# EAGLE design board (EAGLE 9.6.2)
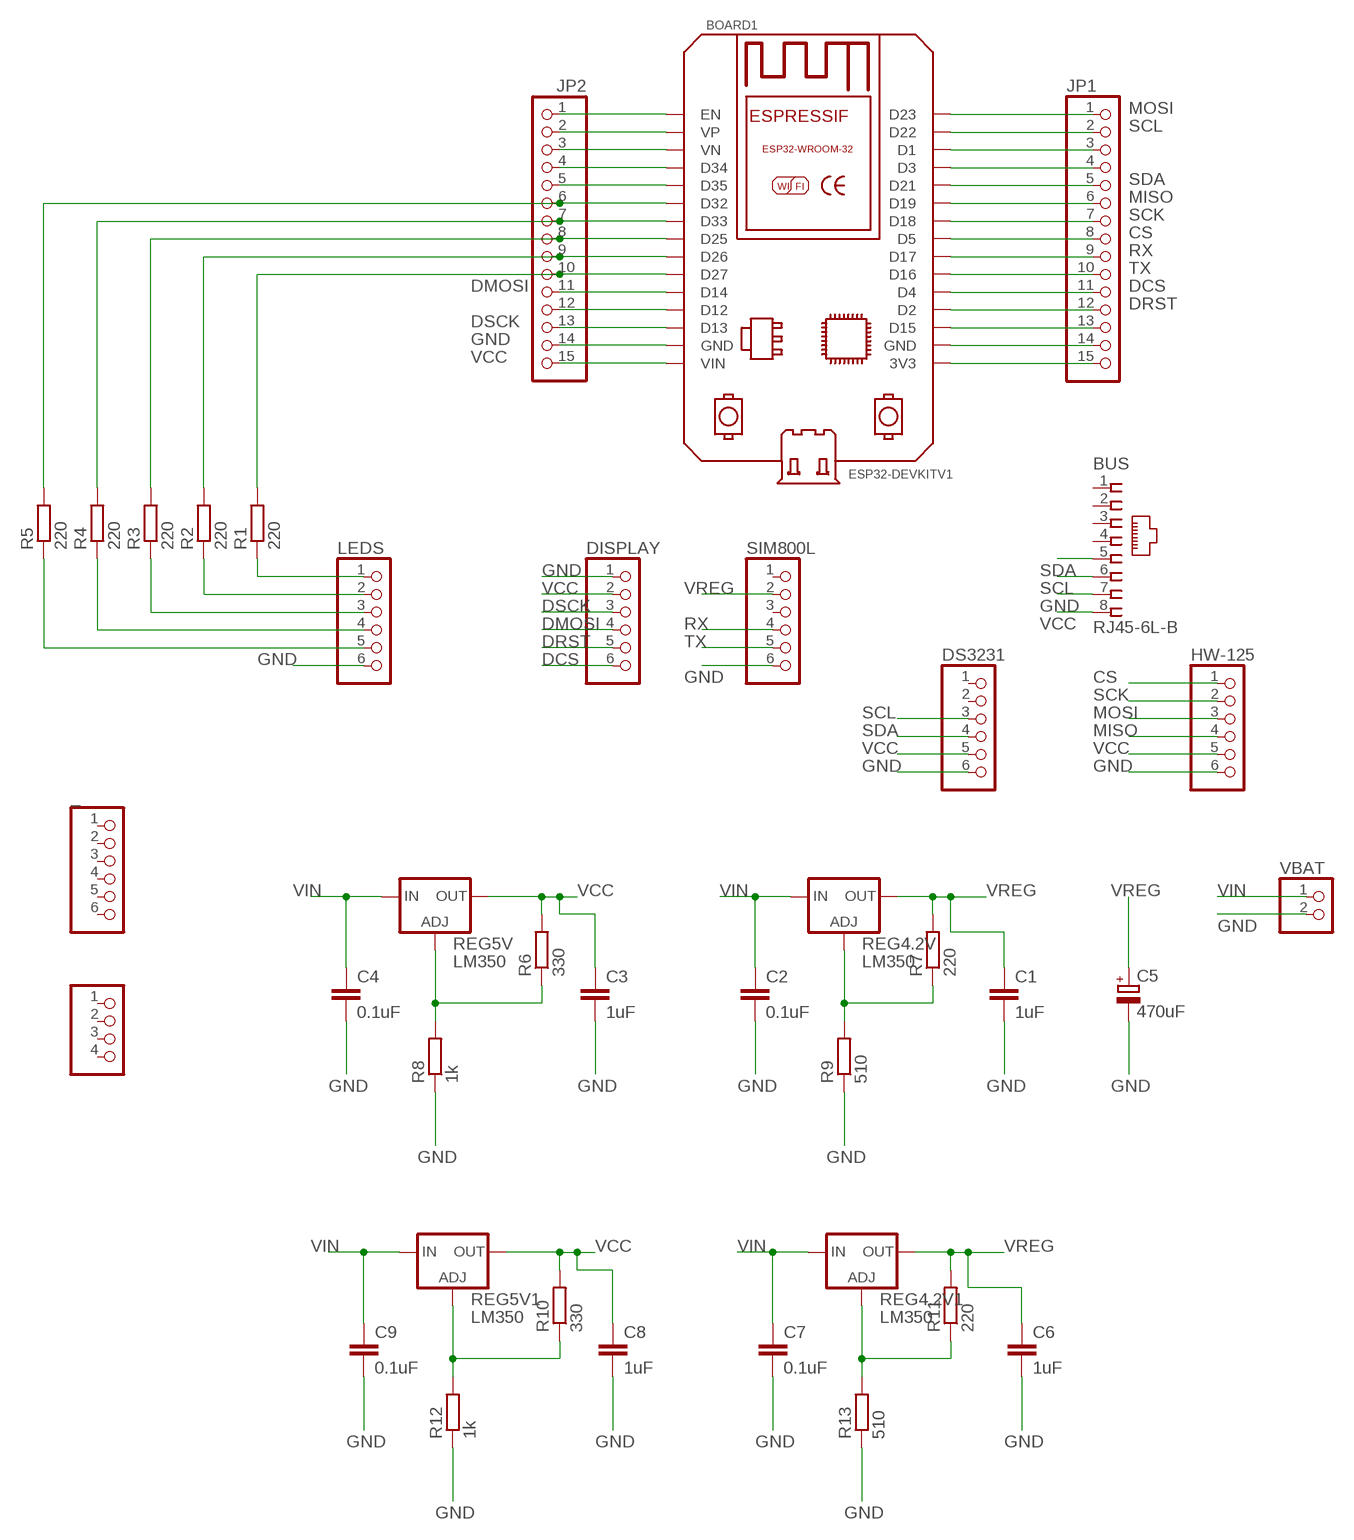
[diagram p0: schematic, sheet 1]

## Parts
_  PINHD-1X6  [1X06]
BOARD1  ESP32DEVKITV1  [ESP32-DEVKITV1]
BUS  RJ45-6L-B  [RJ45-NO-SHIELD]
C1  1uF  C2.5/2  [C2.5-2]
C2  0.1uF  C2.5/2  [C2.5-2]
C3  1uF  C2.5/2  [C2.5-2]
C4  0.1uF  C2.5/2  [C2.5-2]
C5  470uF  CPOL-EUE3.5-8  [E3,5-8]
C6  1uF  C2.5/2  [C2.5-2]
C7  0.1uF  C2.5/2  [C2.5-2]
C8  1uF  C2.5/2  [C2.5-2]
C9  0.1uF  C2.5/2  [C2.5-2]
DISPLAY  PINHD-1X6  [1X06]
DS3231  PINHD-1X6  [1X06]
HW-125  PINHD-1X6  [1X06]
JP1  PINHD-1X15  [1X15]
JP2  PINHD-1X15  [1X15]
JP3  PINHD-1X4  [1X04]
LEDS  PINHD-1X6  [1X06]
R1  220  R-EU_R1206  [R1206]
R2  220  R-EU_R1206  [R1206]
R3  220  R-EU_R1206  [R1206]
R4  220  R-EU_R1206  [R1206]
R5  220  R-EU_R1206  [R1206]
R6  330  R-EU_0204/7  [0204/7]
R7  220  R-EU_0204/7  [0204/7]
R8  1k  R-EU_0204/7  [0204/7]
R9  510  R-EU_0204/7  [0204/7]
R10  330  R-EU_0204/7  [0204/7]
R11  220  R-EU_0204/7  [0204/7]
R12  1k  R-EU_0204/7  [0204/7]
R13  510  R-EU_0204/7  [0204/7]
REG4.2V  LM350  LM317TS  [317TS]
REG4.2V1  LM350  LM317TS  [317TS]
REG5V  LM350  LM317TS  [317TS]
REG5V1  LM350  LM317TS  [317TS]
SIM800L  PINHD-1X6  [1X06]
VBAT  PINHD-1X2  [1X02]

## Nets
CS: BOARD1.D5 HW-125.1 JP1.8
DCS: BOARD1.D4 DISPLAY.6 JP1.11
DMOSI: BOARD1.D14 DISPLAY.4 JP2.11
DRST: BOARD1.D2 DISPLAY.5 JP1.12
DSCK: BOARD1.D13 DISPLAY.3 JP2.13
GND: BOARD1.GND BUS.7 C1.2 C2.2 C3.2 C4.2 C5.- C6.2 C7.2 C8.2 C9.2 DISPLAY.1 DS3231.6 HW-125.6 JP2.14 LEDS.6 R8.1 R9.1 R12.1 R13.1 SIM800L.6 VBAT.2
MISO: BOARD1.D19 HW-125.4 JP1.6
MOSI: BOARD1.D23 HW-125.3 JP1.1
N$1: BOARD1.EN JP2.1
N$2: BOARD1.VP JP2.2
N$3: BOARD1.VN JP2.3
N$4: BOARD1.D34 JP2.4
N$5: BOARD1.D35 JP2.5
N$6: BOARD1.D32 JP2.6 R5.2
N$7: BOARD1.D33 JP2.7 R4.2
N$8: BOARD1.D25 JP2.8 R3.2
N$9: BOARD1.D26 JP2.9 R2.2
N$10: BOARD1.D27 JP2.10 R1.2
N$11: LEDS.1 R1.1
N$12: BOARD1.D12 JP2.12
N$13: LEDS.2 R2.1
N$14: LEDS.3 R3.1
N$15: LEDS.4 R4.1
N$16: LEDS.5 R5.1
N$17: BOARD1.3V3 JP1.15
N$18: BOARD1.D1 JP1.3
N$19: BOARD1.D3 JP1.4
N$20: BOARD1.GND@1(GND) JP1.14
N$21: R6.1 R8.2 REG5V.1(ADJ)
N$22: R7.1 R9.2 REG4.2V.1(ADJ)
N$23: R10.1 R12.2 REG5V1.1(ADJ)
N$24: R11.1 R13.2 REG4.2V1.1(ADJ)
N$28: BOARD1.D15 JP1.13
RX: BOARD1.D17 JP1.9 SIM800L.4
SCK: BOARD1.D18 HW-125.2 JP1.7
SCL: BOARD1.D22 BUS.6 DS3231.3 JP1.2
SDA: BOARD1.D21 BUS.5 DS3231.4 JP1.5
TX: BOARD1.D16 JP1.10 SIM800L.5
VCC: BOARD1.VIN BUS.8 C3.1 C8.1 DISPLAY.2 DS3231.5 HW-125.5 JP2.15 R6.2 R10.2 REG5V1.2(OUT) REG5V.2(OUT)
VIN: C2.1 C4.1 C7.1 C9.1 REG4.2V1.3(IN) REG4.2V.3(IN) REG5V1.3(IN) REG5V.3(IN) VBAT.1
VREG: C1.1 C5.+ C6.1 R7.2 R11.2 REG4.2V1.2(OUT) REG4.2V.2(OUT) SIM800L.2
Unconnected: _.1 _.2 _.3 _.4 _.5 _.6 BUS.1 BUS.2 BUS.3 BUS.4 DS3231.1 DS3231.2 JP3.1 JP3.2 JP3.3 JP3.4 SIM800L.1 SIM800L.3

## Library data of the parts
_ DISPLAY DS3231 HW-125 LEDS SIM800L = pinhead:PINHD-1X6: PIN HEADER
BOARD1 = ESP32-DEVKITV1:ESP32DEVKITV1: https://github.com/shridattdudhat
BUS = con-tycoelectronics:RJ45: CORCOM Modular RJ Jacks No Shield Source: www.tycoelectronics.com .. ENG_DS_1654001_1099_RJ_L_0507.pdf; MPN: RJ45-6L-B; OC_FARNELL: unknown; OC_NEWARK: 16R6090
C1-C4 C6-C9 = capacitor-wima:C: CAPACITOR naming: grid - package width
C5 = rcl:CPOL-EU: POLARIZED CAPACITOR, European symbol; SPICEPREFIX: C
JP1 JP2 = pinhead:PINHD-1X15: PIN HEADER
JP3 = pinhead:PINHD-1X4: PIN HEADER
R1-R13 = rcl:R-EU_: RESISTOR, European symbol; SPICEPREFIX: R
REG4.2V REG4.2V1 REG5V REG5V1 = v-reg:LM317TS: VOLTAGE REGULATOR
VBAT = pinhead:PINHD-1X2: PIN HEADER

## Board
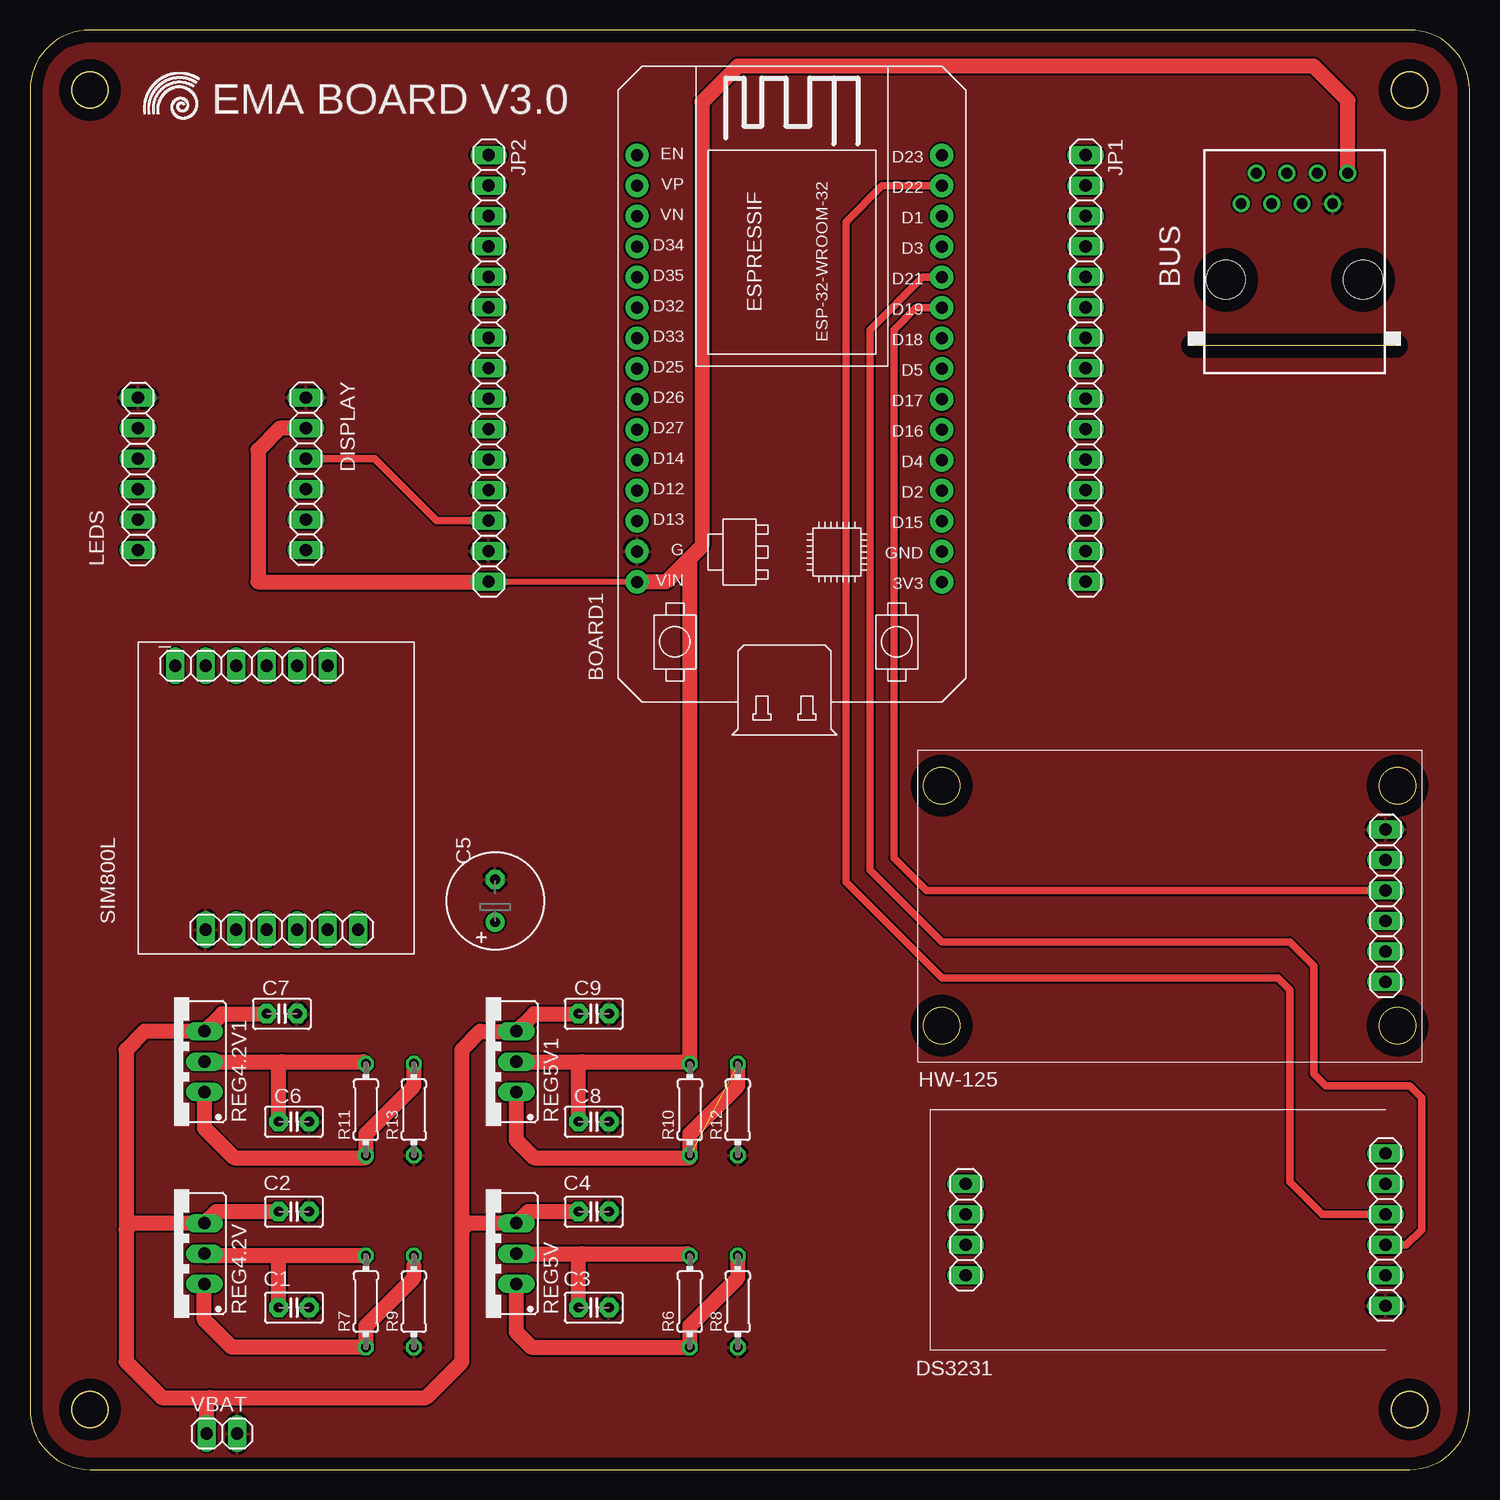
[diagram p1: board, top side]
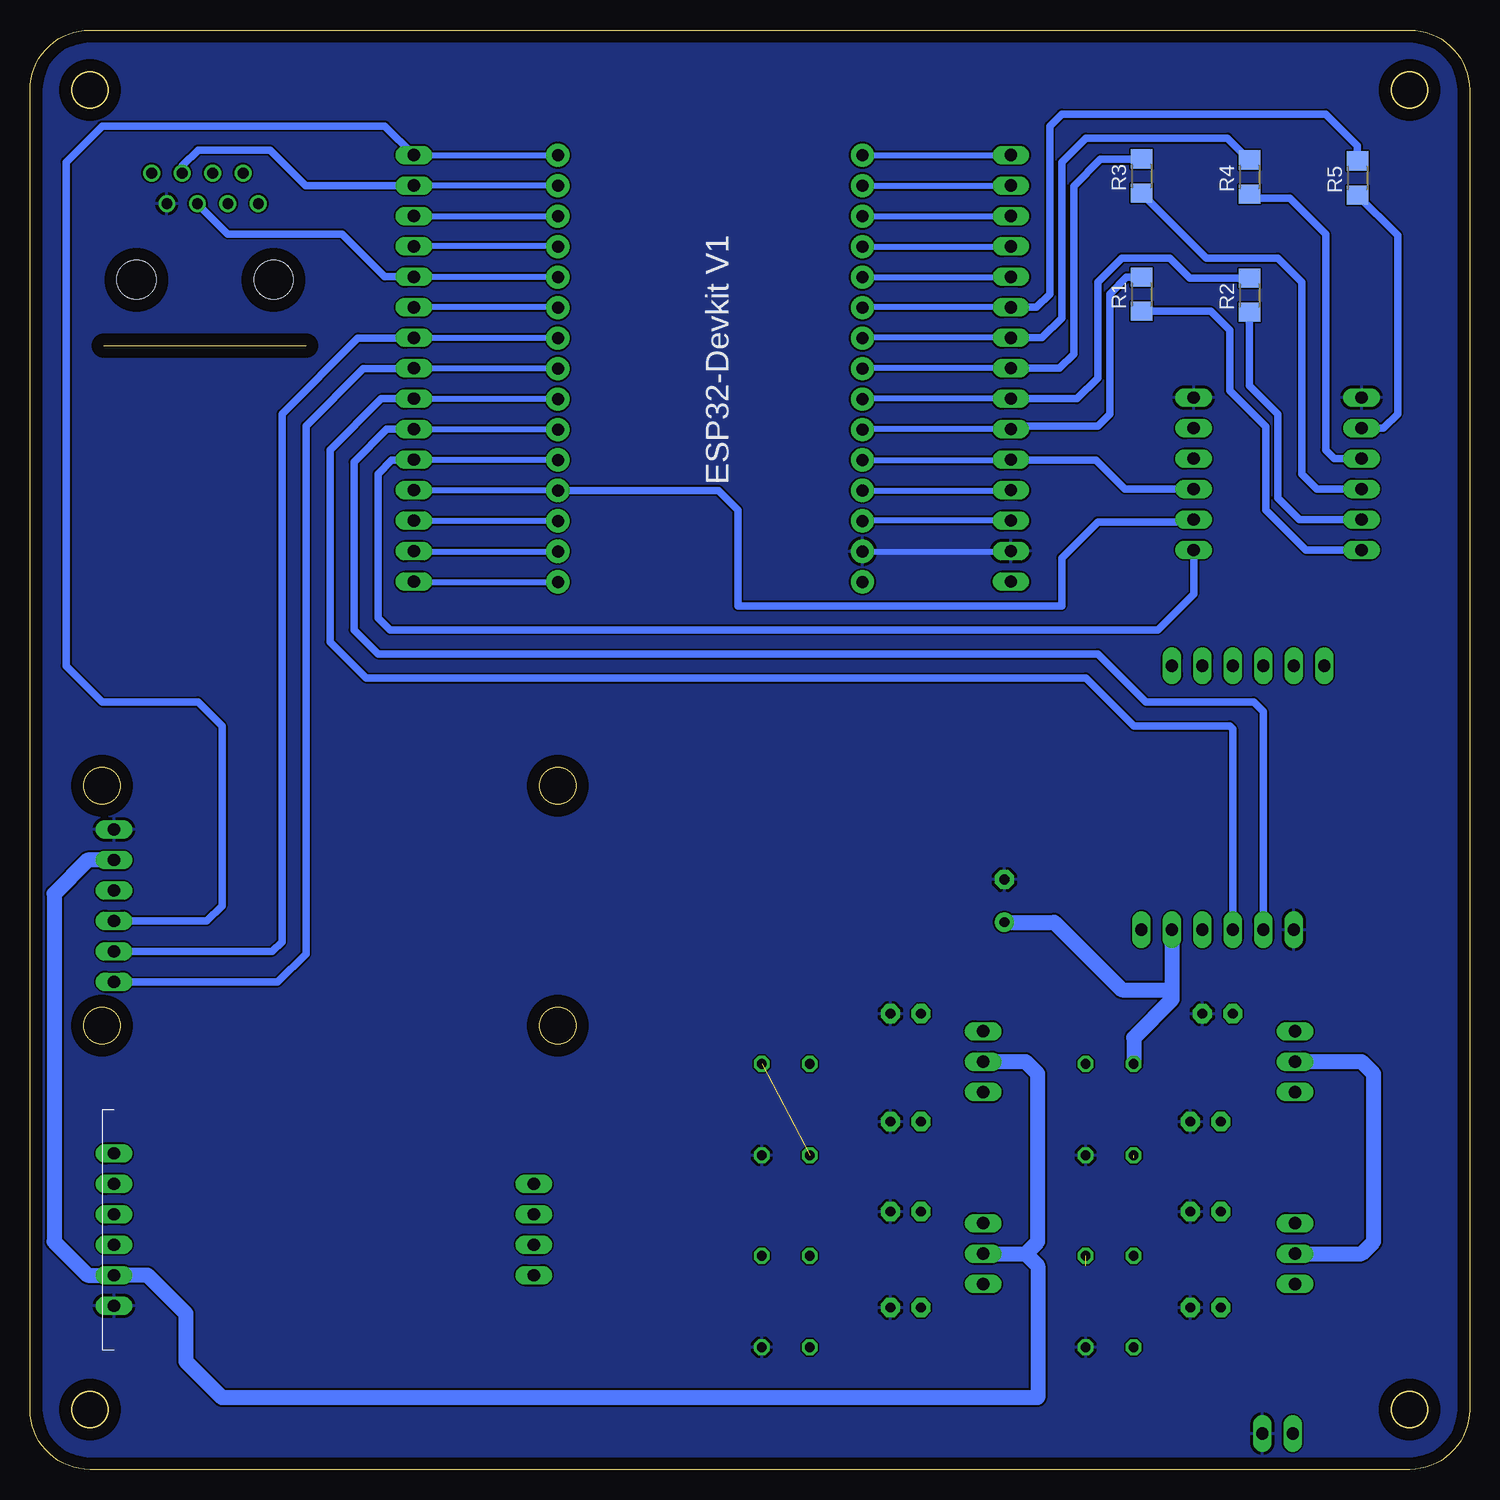
[diagram p2: board, bottom side, seen from below]

Size 120 x 120 mm. Coordinates in mm from the lower left corner, seen from the top.
Outline: 0,115 0,5 arc90 5,0 115,0 arc90 120,5 120,115 arc90 115,120 5,120 arc90 0,115
Outline: circle at 5,115 radius 1.5
Outline: circle at 115,115 radius 1.5
Outline: circle at 5,5 radius 1.5
Outline: circle at 115,5 radius 1.5
Outline: circle at 114,57 radius 1.5
Outline: circle at 114,37 radius 1.5
Outline: circle at 76,37 radius 1.5
Outline: circle at 76,57 radius 1.5
Copper layers (1*16): Top 0.035mm / dielectric 1.5mm / Bottom 0.035mm
Design rules "default": minimum track width 6mil, minimum drill 0.35mm, track to track 6mil, track to pad 6mil, pad to pad 6mil, via to via 6mil, smd to smd 6mil, copper to edge 40mil, drill to drill 6mil, minimum pad ring 10mil, minimum via ring 8mil, stop-mask expansion 4mil, vias tented up to drill 0mil, thermal gap 10mil

### Footprints (pad centres in the part's own frame; a part is rotated, then mirrored left to right if it is on the bottom)
1X06 = drill 1.016 long: 1 -6.35,0; 2 -3.81,0; 3 -1.27,0; 4 1.27,0; 5 3.81,0; 6 6.35,0
ESP32-DEVKITV1 = drill 1 pad 1.93: 3V3 0,0; D1 30.48,0; D2 7.62,0; D3 27.94,0; D4 10.16,0; D5 17.78,0; D12 7.62,25.4; D13 5.08,25.4; D14 10.16,25.4; D15 5.08,0; D16 12.7,0; D17 15.24,0; D18 20.32,0; D19 22.86,0; D21 25.4,0; D22 33.02,0; D23 35.56,0; D25 17.78,25.4; D26 15.24,25.4; D27 12.7,25.4; D32 22.86,25.4; D33 20.32,25.4; D34 27.94,25.4; D35 25.4,25.4; EN 35.56,25.4; GND 2.54,25.4; GND@1 2.54,0; VIN 0,25.4; VN 30.48,25.4; VP 33.02,25.4
RJ45-NO-SHIELD = drill 0.9 pad 1.4: 1 -4.445,6.35; 2 -3.175,8.89; 3 -1.905,6.35; 4 -0.635,8.89; 5 0.635,6.35; 6 1.905,8.89; 7 3.175,6.35; 8 4.445,8.89 | hole 3.251: -5.715,0; 5.715,0
C2.5-2 = drill 0.813 pad 1.6 octagon: 1 -1.27,0; 2 1.27,0
E3,5-8 = drill 0.813 pad 1.6: + -1.778,0 | drill 0.813 pad 1.6 octagon: - 1.778,0
1X15 = drill 1.016 long: 1 -17.78,0; 2 -15.24,0; 3 -12.7,0; 4 -10.16,0; 5 -7.62,0; 6 -5.08,0; 7 -2.54,0; 8 0,0; 9 2.54,0; 10 5.08,0; 11 7.62,0; 12 10.16,0; 13 12.7,0; 14 15.24,0; 15 17.78,0
1X04 = drill 1.016 long: 1 -3.81,0; 2 -1.27,0; 3 1.27,0; 4 3.81,0
R1206 = smd 1.6 x 1.803: 1 -1.422,0; 2 1.422,0
0204/7 = drill 0.813 octagon: 1 -3.81,0; 2 3.81,0
317TS = drill 1.016 long: 1 -2.54,-2.54; 2 0,-2.54; 3 2.54,-2.54
1X02 = drill 1.016 long: 1 -1.27,0; 2 1.27,0

### Placement (x,y rotation side)
_  18.46,67 0 top
BOARD1  76,74 90 top
BUS  105.41,99.18 0 top
C1  22,13.5 0 top
C2  22,21.5 0 top
C3  47,13.5 0 top
C4  47,21.5 0 top
C5  38.78,47.4 90 top
C6  22,29 0 top
C7  21,38 0 top
C8  47,29 0 top
C9  47,38 0 top
DISPLAY  23,83 270 top
DS3231  113,20 270 top
HW-125  113,47 90 top
JP1  88,91.8 270 top
JP2  38.23,91.8 270 top
JP3  78,20 90 top
LEDS  9,83 90 top
R1  27.34,97.98 90 bottom
R2  18.34,97.9 90 bottom
R3  27.34,107.82 90 bottom
R4  18.34,107.74 90 bottom
R5  9.34,107.66 90 bottom
R6  55,14 90 top
R7  28,14 90 top
R8  59,14 90 top
R9  32,14 90 top
R10  55,30 90 top
R11  28,30 90 top
R12  59,30 90 top
R13  32,30 90 top
REG4.2V  12,18 90 top
REG4.2V1  12,34 90 top
REG5V  38,18 90 top
REG5V1  38,34 90 top
SIM800L  21,45 180 top
VBAT  16,3 0 top

### Tracks (layer width: path | path; a pad name or v marks a point on that pad's centre or on a via)
CS
  Bottom 0.508: BOARD1.D5 87.98,91.78 JP1.8
  Bottom 0.61: HW-125.1 99.35,40.65 97,43 97,87 92.22,91.78 87.98,91.78
DCS
  Bottom 0.508: BOARD1.D4 87.98,84.16 JP1.11
  Bottom 0.61: DISPLAY.6 23,73 26,70 90,70 91,71 91,83 89.84,84.16 87.98,84.16
DMOSI
  Bottom 0.508: BOARD1.D14 38.25,84.16 JP2.11
  Bottom 0.61: DISPLAY.4 28.73,81.73 31.16,84.16 38.25,84.16
DRST
  Bottom 0.508: BOARD1.D2 87.98,81.62 JP1.12
  Bottom 0.61: DISPLAY.5 23.19,79 31,79 34,76 34,72 61,72 61,80 62.62,81.62 BOARD1.D2
DSCK
  Top 0.61: DISPLAY.3 28.73,84.27 33.9,79.1 JP2.13
  Bottom 0.508: JP2.13 50.58,79.1 BOARD1.D13
GND
  Bottom 0.508: BOARD1.GND 38.25,76.54 JP2.14
  pour Top: 115.59,1 4.41,1 arc-90 1,4.41 1,115.59 arc-90 4.41,119 115.59,119 arc-90 119,115.59 119,4.41 arc-90
  pour Bottom: 115.59,1 4.41,1 arc-90 1,4.41 1,115.59 arc-90 4.41,119 115.59,119 arc-90 119,115.59 119,4.41 arc-90
MISO
  Top 0.61: BOARD1.D19 73.86,96.86 72,95 72,51 74.73,48.27 HW-125.4
  Bottom 0.508: BOARD1.D19 76.02,96.88 JP1.6
MOSI
  Bottom 0.508: JP1.1 76.02,109.58 BOARD1.D23
  Bottom 0.61: JP1.1 90.42,112 114,112 117,109 117,67 114,64 106,64 104,62 104,47 105.27,45.73 HW-125.3
N$1
  Bottom 0.508: BOARD1.EN 38.25,109.56 JP2.1
N$2
  Bottom 0.508: BOARD1.VP 38.25,107.02 JP2.2
N$3
  Bottom 0.508: BOARD1.VN 38.25,104.48 JP2.3
N$4
  Bottom 0.508: BOARD1.D34 38.25,101.94 JP2.4
N$5
  Bottom 0.508: BOARD1.D35 38.25,99.4 JP2.5
N$6
  Bottom 0.508: JP2.6 50.58,96.88 BOARD1.D32
  Bottom 0.61: JP2.6 36.12,96.88 35,98 35,112 34,113 12,113 9.34,110.34 R5.2
N$7
  Bottom 0.508: JP2.7 50.58,94.34 BOARD1.D33
  Bottom 0.61: JP2.7 35.66,94.34 34,96 34,109 32,111 20.18,111 R4.2
N$8
  Bottom 0.508: JP2.8 50.58,91.8 BOARD1.D25
  Bottom 0.61: JP2.8 34.2,91.8 33,93 33,107 30.76,109.24 R3.2
N$9
  Bottom 0.508: JP2.9 50.58,89.26 BOARD1.D26
  Bottom 0.61: R2.2 23.32,99.32 25,101 29,101 31,99 31,91 32.74,89.26 JP2.9
N$10
  Bottom 0.508: JP2.10 50.58,86.72 BOARD1.D27
  Bottom 0.61: JP2.10 37.95,87 31,87 30,88 30,98 28.6,99.4 R1.2
N$11
  Bottom 0.61: LEDS.1 13.65,76.65 17,80 17,86.92 18.04,87.96 20,89.92 20,95 21.56,96.56 R1.1
N$12
  Bottom 0.508: BOARD1.D12 38.25,81.62 JP2.12
N$13
  Bottom 0.61: R2.1 18.34,90.34 16,88 16,81 14.19,79.19 LEDS.2
N$14
  Bottom 0.61: R3.1 21.94,101 16,101 14,99 14,83 12.73,81.73 LEDS.3
N$15
  Bottom 0.61: R4.1 18.02,106 15,106 12,103 12,85 11.27,84.27 LEDS.4
N$16
  Bottom 0.61: R5.1 6,102.9 6,88 7.19,86.81 LEDS.5
N$17
  Bottom 0.508: JP1.15 87.98,74 BOARD1.3V3
N$18
  Bottom 0.508: JP1.3 76.02,104.5 BOARD1.D1
N$19
  Bottom 0.508: BOARD1.D3 76.02,101.96 JP1.4
N$20
  Bottom 0.508: JP1.14 87.98,76.54 BOARD1.GND@1
N$21
  Top 1.27: REG5V.1 40.54,11.46 41.81,10.19 R6.1 55,12 59,16 R8.2
N$22  (1 unrouted)
  Top 1.27: REG4.2V.1 14.54,12.46 16.81,10.19 R7.1 28,12 32,16 32,17
N$23  (1 unrouted)
  Top 1.27: REG5V1.1 40.54,27.46 42,26 55,26 55,28 59,32 R12.2
N$24  (1 unrouted)
  Top 1.27: R11.1 28,28 32,32 R13.2 | REG4.2V1.1 14.54,28.46 17,26 28,26
N$28
  Bottom 0.508: BOARD1.D15 87.98,79.08 JP1.13
RX
  Bottom 0.508: BOARD1.D17 87.98,89.24 JP1.9
  Bottom 0.61: JP1.9 90.74,89.26 95,85 95,69 92,66 32,66 28,62 20,62 19.73,61.73 SIM800L.4
SCK
  Bottom 0.508: BOARD1.D18 87.98,94.32 JP1.7
  Bottom 0.61: HW-125.2 99.81,43.19 99,44 99,88 92.68,94.32 87.98,94.32
SCL
  Top 0.61: BOARD1.D22 71.02,107.02 68,104 68,49 76,41 104,41 105,40 105,24 107.73,21.27 DS3231.3
  Bottom 0.508: BOARD1.D22 87.98,107.02 JP1.2
  Bottom 0.61: JP1.2 97.04,107.04 100,110 106,110 107.31,108.69 BUS.6
SDA
  Top 0.61: BOARD1.D21 74.4,99.4 70,95 70,50 76,44 105,44 107,42 107,33 108,32 115,32 116,31 116,20 114.73,18.73 DS3231.4
  Bottom 0.508: JP1.5 76.02,99.42 BOARD1.D21
  Bottom 0.61: JP1.5 90.42,99.42 94,103 103.52,103 BUS.5
TX
  Bottom 0.508: BOARD1.D16 87.98,86.7 JP1.10
  Bottom 0.61: JP1.10 90.28,86.72 93,84 93,70 91,68 31,68 27,64 18,64 17.19,63.19 SIM800L.5
VCC
  Top 0.508: BOARD1.VIN 38.25,74 JP2.15
  Top 1.27: BUS.8 109.86,114.14 107,117 59,117 56,114 56,77 55,76 | 55,76 53,74 BOARD1.VIN | REG5V.2 46,18 | 46,18 54.81,18 R6.2 | C3.1 45.73,17.73 46,18 | REG5V1.2 46,34 | 46,34 54.81,34 R10.2 55,76 | C8.1 45.73,33.73 46,34 | DISPLAY.2 20.81,86.81 19,85 19,74 38.21,74 JP2.15
  Bottom 1.27: 37,18 36,19 36,33 37,34 REG5V1.2 | REG5V.2 37,18 | 37,18 36,17 36,6 104,6 107,9 107,13 110.19,16.19 DS3231.5 115.19,16.19 118,19 118,48 115.19,50.81 HW-125.5
VIN
  Top 1.27: C4.1 41.5,21.5 REG5V.3 36.54,20.54 36,20 | C2.1 15.5,21.5 REG4.2V.3 8.54,20.54 8,20 | C9.1 42,38 REG5V1.3 37.54,36.54 36,35 36,20 | C7.1 16,38 REG4.2V1.3 9.54,36.54 8,35 8,20 | 8,20 8,9 11,6 15,6 | 15,6 33,6 36,9 36,20 | VBAT.1 14.73,5.73 15,6
VREG
  Top 1.27: R7.2 21,17.81 | 21,17.81 14.73,17.81 REG4.2V.2 | C1.1 20.73,17.54 21,17.81 | REG4.2V1.2 21,34 | 21,34 27.81,34 R11.2 | C6.1 20.73,33.73 21,34
  Bottom 1.27: REG4.2V.2 9,18 8,19 8,33 9,34 REG4.2V1.2 | SIM800L.2 24.81,40 | 24.81,40 24.81,39.19 28,36 R11.2 | C5.+ 34.62,45.62 29,40 24.81,40

### Text on the board
tPlace: EMA BOARD V3.0